# Altium project Rear_Power_Lower.PrjPcb
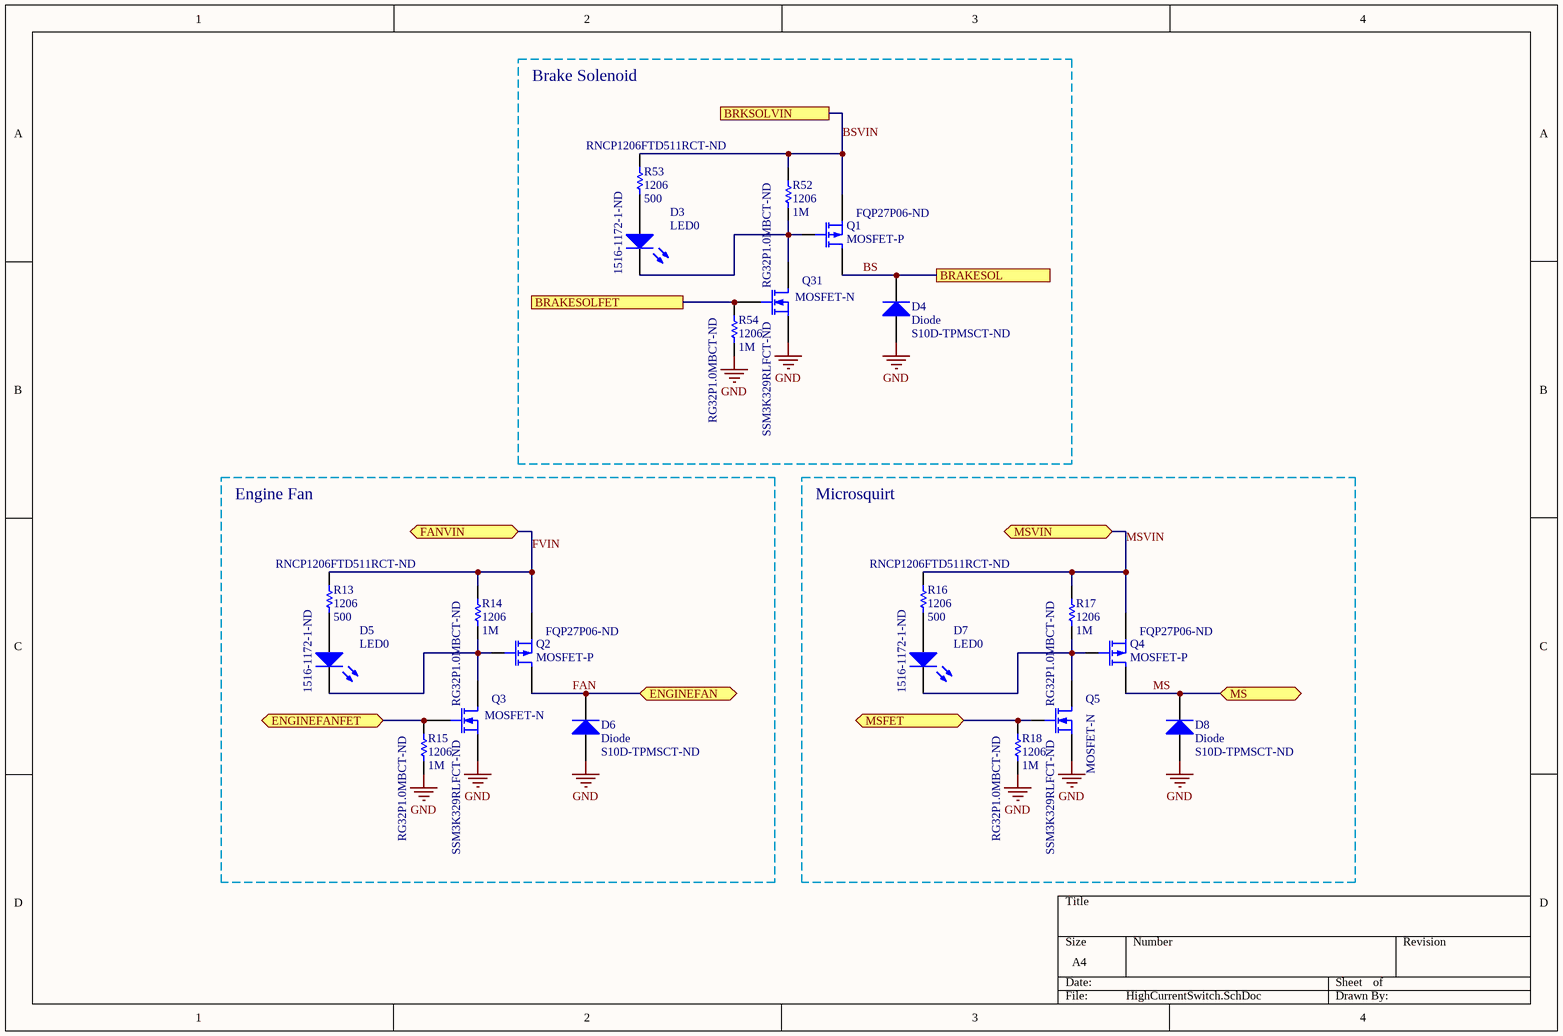
[diagram p0: HighCurrentSwitch.SchDoc]
5 sheets, 87 parts. Net scope: flat (ports and power ports of the same name join across sheets).
Board file: RPD_lower.PcbDoc
Sheets:
  HighCurrentSwitch.SchDoc
  RearPowerLower.SchDoc
  LowCurrentSwitch.SchDoc
  SpareSwitch.SchDoc
  Controller.SchDoc

## Sheet HighCurrentSwitch.SchDoc
size A4

### Parts
D3  LED0  Supplier Part Number 1: 1516-1172-1-ND  [C1206]
D4  Diode  Supplier Part Number 1: S10D-TPMSCT-ND  [S10D-TP]
D5  LED0  Supplier Part Number 1: 1516-1172-1-ND  [C1206]
D6  Diode  Supplier Part Number 1: S10D-TPMSCT-ND  [S10D-TP]
D7  LED0  Supplier Part Number 1: 1516-1172-1-ND  [C1206]
D8  Diode  Supplier Part Number 1: S10D-TPMSCT-ND  [S10D-TP]
Q1  MOSFET-P  Supplier Part Number 1: FQP27P06-ND  [TO-220]
Q2  MOSFET-P  Supplier Part Number 1: FQP27P06-ND  [TO-220]
Q3  MOSFET-N  Supplier Part Number 1: SSM3K329RLFCT-ND  [SOT23f]
Q4  MOSFET-P  Supplier Part Number 1: FQP27P06-ND  [TO-220]
Q5  MOSFET-N  Supplier Part Number 1: SSM3K329RLFCT-ND  [SOT23f]
Q31  MOSFET-N  Supplier Part Number 1: SSM3K329RLFCT-ND  [SOT23f]
R13  1206  value 500  Supplier Part Number 1: RNCP1206FTD511RCT-ND  [C1206]
R14  1206  value 1M  Supplier Part Number 1: RG32P1.0MBCT-ND  [1206 (High Density)]
R15  1206  value 1M  Supplier Part Number 1: RG32P1.0MBCT-ND  [1206 (High Density)]
R16  1206  value 500  Supplier Part Number 1: RNCP1206FTD511RCT-ND  [C1206]
R17  1206  value 1M  Supplier Part Number 1: RG32P1.0MBCT-ND  [1206 (High Density)]
R18  1206  value 1M  Supplier Part Number 1: RG32P1.0MBCT-ND  [1206 (High Density)]
R52  1206  value 1M  Supplier Part Number 1: RG32P1.0MBCT-ND  [1206 (High Density)]
R53  1206  value 500  Supplier Part Number 1: RNCP1206FTD511RCT-ND  [C1206]
R54  1206  value 1M  Supplier Part Number 1: RG32P1.0MBCT-ND  [1206 (High Density)]

### Blocks framed on the sheet
Brake Solenoid: D3 D4 Q1 Q31 R52-R54
Engine Fan: D5 D6 Q2 Q3 R13-R15
Microsquirt: D7 D8 Q4 Q5 R16-R18

### Ports
BRAKESOL, BRAKESOLFET, BRKSOLVIN, ENGINEFAN (bidir), ENGINEFANFET (bidir), FANVIN (bidir), MS (bidir), MSFET (bidir), MSVIN (bidir)

### Nets
GND: D4.1(A) D6.1(A) D8.1(A) Q3.3(S) Q5.3(S) Q31.3(S) R15.1 R18.1 R54.1
BS: D4.2(K) Q1.2(D) ; port BRAKESOL
BSVIN: Q1.3(S) R52.2 R53.1 ; port BRKSOLVIN
FAN: D6.2(K) Q2.2(D) ; port ENGINEFAN
FVIN: Q2.3(S) R13.1 R14.2 ; port FANVIN
MS: D8.2(K) Q4.2(D) ; port MS
MSVIN: Q4.3(S) R16.1 R17.2 ; port MSVIN
NetD3_1: D3.1(A) R53.2
NetD3_2: D3.2(K) Q1.1(G) Q31.1(D) R52.1
NetD5_1: D5.1(A) R13.2
NetD5_2: D5.2(K) Q2.1(G) Q3.1(D) R14.1
NetD7_1: D7.1(A) R16.2
NetD7_2: D7.2(K) Q4.1(G) Q5.1(D) R17.1
NetQ3_2: Q3.2(G) R15.2 ; port ENGINEFANFET
NetQ5_2: Q5.2(G) R18.2 ; port MSFET
NetQ31_2: Q31.2(G) R54.2 ; port BRAKESOLFET

### Library data of the parts
D3 D5 D7 = LED0: Typical INFRARED GaAs LED; Published: 8-Jun-2000; LatestRevisionDate: 08-Jul-2005; LatestRevisionNote: Mech Layer 1 removed.; PackageReference: LED-0; Publisher: Altium Limited; PackageDescription: LED; 2 Leads; Supplier 1: Digi-Key
D4 D6 D8 = Diode: Default Diode; Published: 8-Jun-2000; LatestRevisionDate: 17-Jul-2002; LatestRevisionNote: Re-released for DXP Platform.; PackageVersion: Sep-1996; PackageReference: SMC; Publisher: Altium Limited; PackageDescription: DO-214-AB/SMC; 2 C-Bend Leads; Body 7.9 x 5.9 mm, inc. leads (LxW); Code_JEDEC: DO-214-AB; Supplier 1: Digi-Key
Q1 Q2 Q4 = MOSFET-P: P-Channel MOSFET; Published: 8-Jun-2000; LatestRevisionDate: 17-Jul-2002; LatestRevisionNote: Re-released for DXP Platform.; PackageVersion: 1995/1996; PackageReference: E3; Publisher: Altium Limited; PackageDescription: TO, Flat Index; 3 In-Line, Axial Leads; Body Dia. 4.6mm; Lead Dia. 0.5 mm (max); Supplier 1: Digi-Key
Q3 Q5 Q31 = MOSFET-N: N-Channel MOSFET; Published: 8-Jun-2000; LatestRevisionDate: 17-Jul-2002; LatestRevisionNote: Re-released for DXP Platform.; PackageVersion: 1995/1996; PackageReference: E3; Publisher: Altium Limited; PackageDescription: TO, Flat Index; 3 In-Line, Axial Leads; Body Dia. 4.6mm; Lead Dia. 0.5 mm (max); Supplier 1: Digi-Key
R13-R18 R53 R54 = Res1: Resistor; Published: 8-Jun-2000; LatestRevisionDate: 17-Jul-2002; LatestRevisionNote: Re-released for DXP Platform.; PackageReference: AXIAL-0.3; Publisher: Altium Limited; PackageDescription: Axial Device, Thru-Hole; 2 Leads; 0.3 in Pin Spacing; Supplier 1: Digi-Key
R52 = Res1: 1M Resistor; Published: 8-Jun-2000; LatestRevisionDate: 17-Jul-2002; LatestRevisionNote: Re-released for DXP Platform.; PackageReference: AXIAL-0.3; Publisher: Altium Limited; PackageDescription: Axial Device, Thru-Hole; 2 Leads; 0.3 in Pin Spacing; Supplier 1: Digi-Key

## Sheet RearPowerLower.SchDoc
size A4
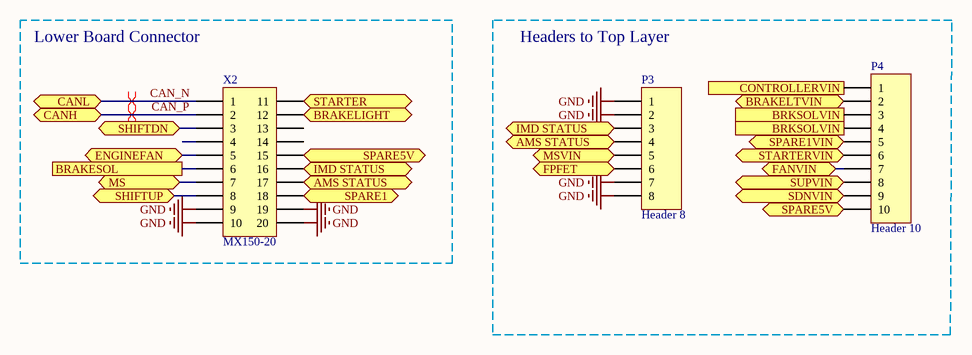
[diagram p1: RearPowerLower.SchDoc]

### Parts
P3  Header 8  [HDR1X8]
P4  Header 10  [HDR1X10]
X2  MX150-20  [20 Pin MX150]

### Blocks framed on the sheet
Lower Board Connector: X2
Headers to Top Layer: P3 P4

### Ports
AMS STATUS (bidir), BRAKELIGHT (bidir), BRAKELTVIN (bidir), BRAKESOL, BRKSOLVIN, CANH (bidir), CANL (bidir), CONTROLLERVIN, ENGINEFAN (bidir), FANVIN (bidir), FPFET (bidir), IMD STATUS (bidir), MS (bidir), MSVIN (bidir), SDNVIN (bidir), SHIFTDN (bidir), SHIFTUP (bidir), SPARE1 (bidir), SPARE1VIN (bidir), SPARE5V (bidir), STARTER (bidir), STARTERVIN (bidir), SUPVIN (bidir)

### Nets
GND: P3.1 P3.2 P3.7 P3.8 X2.9 X2.10 X2.19 X2.20
BS: X2.6 ; port BRAKESOL
BSVIN: P4.3 P4.4 ; port BRKSOLVIN
CAN_N: X2.1 ; port CANL
CAN_P: X2.2 ; port CANH
FAN: X2.5 ; port ENGINEFAN
FVIN: P4.7 ; port FANVIN
MS: X2.7 ; port MS
MSVIN: P3.5 ; port MSVIN
VIN: P4.1 ; port CONTROLLERVIN
NetD10_2: X2.3 ; port SHIFTDN
NetD13_2: X2.8 ; port SHIFTUP
NetD15_2: X2.11 ; port STARTER
NetD16_2: X2.12 ; port BRAKELIGHT
NetD20_2: X2.18 ; port SPARE1
NetP3_3: P3.3 X2.16 ; port IMD STATUS
NetP3_4: P3.4 X2.17 ; port AMS STATUS
NetP3_6: P3.6 ; port FPFET
NetP4_2: P4.2 ; port BRAKELTVIN
NetP4_5: P4.5 ; port SPARE1VIN
NetP4_6: P4.6 ; port STARTERVIN
NetP4_8: P4.8 ; port SUPVIN
NetP4_9: P4.9 ; port SDNVIN
NetP4_10: P4.10 X2.15 ; port SPARE5V

Not connected (* = marked no-connect by the designer): X2 4 13 14

### Layout directives
differential pair: CAN_N, CAN_P

### Library data of the parts
P3 = Header 8: Header, 8-Pin; LatestRevisionDate: 17-Jul-2002; LatestRevisionNote: Re-released for DXP Platform.; Publisher: Altium Limited; Supplier 1: Digi-key; Supplier Part Number 1: S7006-ND; Supplier Part Number 2: *
P4 = Header 10: Header, 10-Pin; LatestRevisionDate: 17-Jul-2002; LatestRevisionNote: Re-released for DXP Platform.; Publisher: Altium Limited; Supplier 1: Digi-Key; Supplier Part Number 1: S7008-ND; Supplier Part Number 2: *
X2 = Header 10X2A: Header, 10-Pin, Dual row; LatestRevisionDate: 17-Jul-2002; LatestRevisionNote: Re-released for DXP Platform.; Publisher: Altium Limited

## Sheet LowCurrentSwitch.SchDoc
size A4
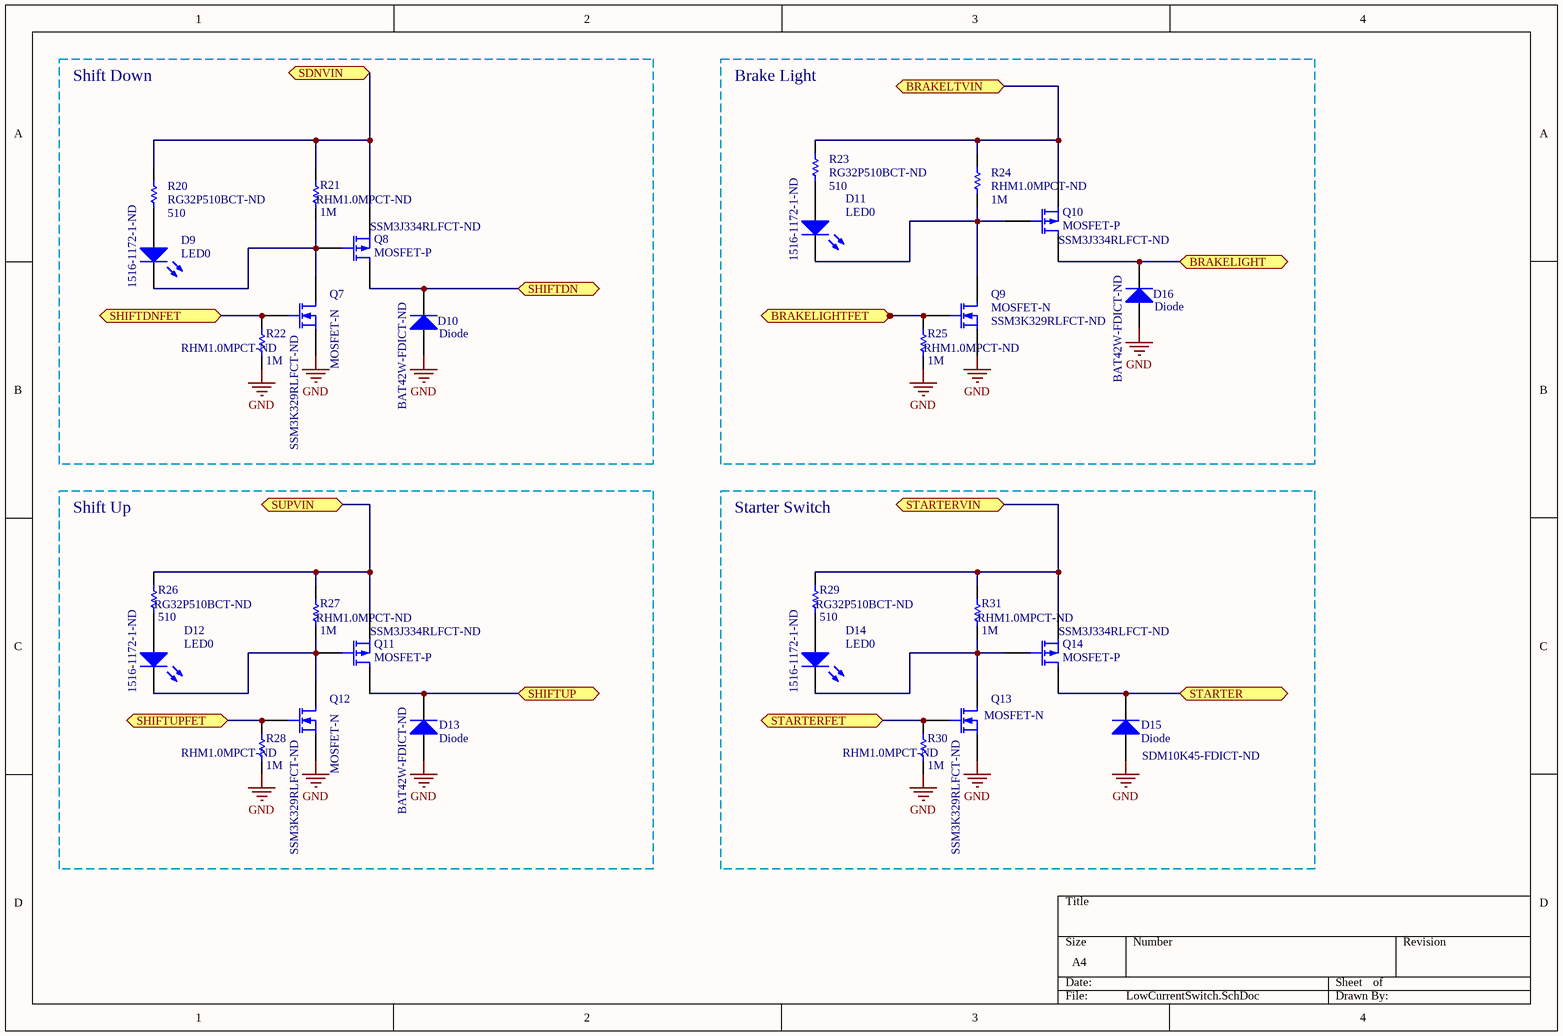
[diagram p2: LowCurrentSwitch.SchDoc]

### Parts
D9  LED0  Supplier Part Number 1: 1516-1172-1-ND  [C1206]
D10  Diode  Supplier Part Number 1: BAT42W-FDICT-ND  [sod-123]
D11  LED0  Supplier Part Number 1: 1516-1172-1-ND  [C1206]
D12  LED0  Supplier Part Number 1: 1516-1172-1-ND  [C1206]
D13  Diode  Supplier Part Number 1: BAT42W-FDICT-ND  [sod-123]
D14  LED0  Supplier Part Number 1: 1516-1172-1-ND  [C1206]
D15  Diode  Supplier Part Number 1: SDM10K45-FDICT-ND  [SOD-323]
D16  Diode  Supplier Part Number 1: BAT42W-FDICT-ND  [sod-123]
Q7  MOSFET-N  Supplier Part Number 1: SSM3K329RLFCT-ND  [SOT23f]
Q8  MOSFET-P  Supplier Part Number 1: SSM3J334RLFCT-ND  [SOT23f]
Q9  MOSFET-N  Supplier Part Number 1: SSM3K329RLFCT-ND  [SOT23f]
Q10  MOSFET-P  Supplier Part Number 1: SSM3J334RLFCT-ND  [SOT23f]
Q11  MOSFET-P  Supplier Part Number 1: SSM3J334RLFCT-ND  [SOT23f]
Q12  MOSFET-N  Supplier Part Number 1: SSM3K329RLFCT-ND  [SOT23f]
Q13  MOSFET-N  Supplier Part Number 1: SSM3K329RLFCT-ND  [SOT23f]
Q14  MOSFET-P  Supplier Part Number 1: SSM3J334RLFCT-ND  [SOT23f]
R20  value 510  Supplier Part Number 1: RG32P510BCT-ND  [C1206]  (hidden comment: 1206)
R21  value 1M  Supplier Part Number 1: RHM1.0MPCT-ND  [C1206]  (hidden comment: 1206)
R22  value 1M  Supplier Part Number 1: RHM1.0MPCT-ND  [C1206]  (hidden comment: 1206)
R23  value 510  Supplier Part Number 1: RG32P510BCT-ND  [C1206]  (hidden comment: 1206)
R24  value 1M  Supplier Part Number 1: RHM1.0MPCT-ND  [C1206]  (hidden comment: Res1)
R25  value 1M  Supplier Part Number 1: RHM1.0MPCT-ND  [C1206]  (hidden comment: Res1)
R26  value 510  Supplier Part Number 1: RG32P510BCT-ND  [C1206]  (hidden comment: 1206)
R27  value 1M  Supplier Part Number 1: RHM1.0MPCT-ND  [C1206]  (hidden comment: 1206)
R28  value 1M  Supplier Part Number 1: RHM1.0MPCT-ND  [C1206]  (hidden comment: 1206)
R29  value 510  Supplier Part Number 1: RG32P510BCT-ND  [C1206]  (hidden comment: 1206)
R30  value 1M  Supplier Part Number 1: RHM1.0MPCT-ND  [C1206]  (hidden comment: 1206)
R31  value 1M  Supplier Part Number 1: RHM1.0MPCT-ND  [C1206]  (hidden comment: 1206)

### Blocks framed on the sheet
Shift Down: D9 D10 Q7 Q8 R20-R22
Brake Light: D11 D16 Q9 Q10 R23-R25
Shift Up: D12 D13 Q11 Q12 R26-R28
Starter Switch: D14 D15 Q13 Q14 R29-R31

### Ports
BRAKELIGHT (bidir), BRAKELIGHTFET (bidir), BRAKELTVIN (bidir), SDNVIN (bidir), SHIFTDN (bidir), SHIFTDNFET (bidir), SHIFTUP (bidir), SHIFTUPFET (bidir), STARTER (bidir), STARTERFET (bidir), STARTERVIN (bidir), SUPVIN (bidir)

### Nets
GND: D10.1(A) D13.1(A) D15.1(A) D16.1(A) Q7.3(S) Q9.3(S) Q12.3(S) Q13.3(S) R22.1 R25.1 R28.1 R30.1
NetD9_1: D9.1(A) R20.2
NetD9_2: D9.2(K) Q7.1(D) Q8.2(G) R21.1
NetD10_2: D10.2(K) Q8.1(D) ; port SHIFTDN
NetD11_1: D11.1(A) R23.2
NetD11_2: D11.2(K) Q9.1(D) Q10.2(G) R24.1
NetD12_1: D12.1(A) R26.2
NetD12_2: D12.2(K) Q11.2(G) Q12.1(D) R27.1
NetD13_2: D13.2(K) Q11.1(D) ; port SHIFTUP
NetD14_1: D14.1(A) R29.2
NetD14_2: D14.2(K) Q13.1(D) Q14.2(G) R31.1
NetD15_2: D15.2(K) Q14.1(D) ; port STARTER
NetD16_2: D16.2(K) Q10.1(D) ; port BRAKELIGHT
NetP4_2: Q10.3(S) R23.1 R24.2 ; port BRAKELTVIN
NetP4_6: Q14.3(S) R29.1 R31.2 ; port STARTERVIN
NetP4_8: Q11.3(S) R26.1 R27.2 ; port SUPVIN
NetP4_9: Q8.3(S) R20.1 R21.2 ; port SDNVIN
NetQ7_2: Q7.2(G) R22.2 ; port SHIFTDNFET
NetQ9_2: Q9.2(G) R25.2 ; port BRAKELIGHTFET
NetQ12_2: Q12.2(G) R28.2 ; port SHIFTUPFET
NetQ13_2: Q13.2(G) R30.2 ; port STARTERFET

### Library data of the parts
D9 D11 D12 D14 = LED0: Typical INFRARED GaAs LED; Published: 8-Jun-2000; LatestRevisionDate: 08-Jul-2005; LatestRevisionNote: Mech Layer 1 removed.; PackageReference: LED-0; Publisher: Altium Limited; PackageDescription: LED; 2 Leads; Supplier 1: Digi-Key
D10 D13 D15 D16 = Diode: Default Diode; Published: 8-Jun-2000; LatestRevisionDate: 17-Jul-2002; LatestRevisionNote: Re-released for DXP Platform.; PackageVersion: Sep-1996; PackageReference: SMC; Publisher: Altium Limited; PackageDescription: DO-214-AB/SMC; 2 C-Bend Leads; Body 7.9 x 5.9 mm, inc. leads (LxW); Code_JEDEC: DO-214-AB; Supplier 1: Digi-Key
Q7 Q9 Q12 Q13 = MOSFET-N: N-Channel MOSFET; Published: 8-Jun-2000; LatestRevisionDate: 17-Jul-2002; LatestRevisionNote: Re-released for DXP Platform.; PackageVersion: 1995/1996; PackageReference: E3; Publisher: Altium Limited; PackageDescription: TO, Flat Index; 3 In-Line, Axial Leads; Body Dia. 4.6mm; Lead Dia. 0.5 mm (max); Supplier 1: Digi-Key
Q8 Q10 Q11 Q14 = MOSFET-P: P-Channel MOSFET; Published: 8-Jun-2000; LatestRevisionDate: 17-Jul-2002; LatestRevisionNote: Re-released for DXP Platform.; PackageVersion: 1995/1996; PackageReference: E3; Publisher: Altium Limited; PackageDescription: TO, Flat Index; 3 In-Line, Axial Leads; Body Dia. 4.6mm; Lead Dia. 0.5 mm (max); Supplier 1: Digi-Key
R20-R31 = Res1: Resistor; Published: 8-Jun-2000; LatestRevisionDate: 17-Jul-2002; LatestRevisionNote: Re-released for DXP Platform.; PackageReference: AXIAL-0.3; Publisher: Altium Limited; PackageDescription: Axial Device, Thru-Hole; 2 Leads; 0.3 in Pin Spacing; Supplier 1: Digi-Key

## Sheet SpareSwitch.SchDoc
size A4
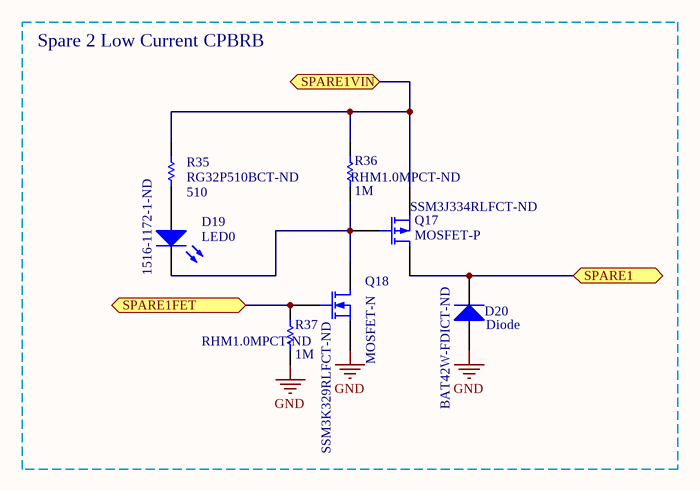
[diagram p3: SpareSwitch.SchDoc]

### Parts
D19  LED0  Supplier Part Number 1: 1516-1172-1-ND  [C1206]
D20  Diode  Supplier Part Number 1: BAT42W-FDICT-ND  [sod-123]
Q17  MOSFET-P  Supplier Part Number 1: SSM3J334RLFCT-ND  [SOT23f]
Q18  MOSFET-N  Supplier Part Number 1: SSM3K329RLFCT-ND  [SOT23f]
R35  value 510  Supplier Part Number 1: RG32P510BCT-ND  [C1206]  (hidden comment: 1206)
R36  value 1M  Supplier Part Number 1: RHM1.0MPCT-ND  [C1206]  (hidden comment: 1206)
R37  value 1M  Supplier Part Number 1: RHM1.0MPCT-ND  [C1206]  (hidden comment: 1206)

### Blocks framed on the sheet
Spare 2 Low Current CPBRB: D19 D20 Q17 Q18 R35-R37

### Ports
SPARE1 (bidir), SPARE1FET (bidir), SPARE1VIN (bidir)

### Nets
GND: D20.1(A) Q18.3(S) R37.1
NetD19_1: D19.1(A) R35.2
NetD19_2: D19.2(K) Q17.2(G) Q18.1(D) R36.1
NetD20_2: D20.2(K) Q17.1(D) ; port SPARE1
NetP4_5: Q17.3(S) R35.1 R36.2 ; port SPARE1VIN
NetQ18_2: Q18.2(G) R37.2 ; port SPARE1FET

### Library data of the parts
D19 = LED0: Typical INFRARED GaAs LED; Published: 8-Jun-2000; LatestRevisionDate: 08-Jul-2005; LatestRevisionNote: Mech Layer 1 removed.; PackageReference: LED-0; Publisher: Altium Limited; PackageDescription: LED; 2 Leads; Supplier 1: Digi-Key
D20 = Diode: Default Diode; Published: 8-Jun-2000; LatestRevisionDate: 17-Jul-2002; LatestRevisionNote: Re-released for DXP Platform.; PackageVersion: Sep-1996; PackageReference: SMC; Publisher: Altium Limited; PackageDescription: DO-214-AB/SMC; 2 C-Bend Leads; Body 7.9 x 5.9 mm, inc. leads (LxW); Code_JEDEC: DO-214-AB; Supplier 1: Digi-Key
Q17 = MOSFET-P: P-Channel MOSFET; Published: 8-Jun-2000; LatestRevisionDate: 17-Jul-2002; LatestRevisionNote: Re-released for DXP Platform.; PackageVersion: 1995/1996; PackageReference: E3; Publisher: Altium Limited; PackageDescription: TO, Flat Index; 3 In-Line, Axial Leads; Body Dia. 4.6mm; Lead Dia. 0.5 mm (max); Supplier 1: Digi-Key
Q18 = MOSFET-N: N-Channel MOSFET; Published: 8-Jun-2000; LatestRevisionDate: 17-Jul-2002; LatestRevisionNote: Re-released for DXP Platform.; PackageVersion: 1995/1996; PackageReference: E3; Publisher: Altium Limited; PackageDescription: TO, Flat Index; 3 In-Line, Axial Leads; Body Dia. 4.6mm; Lead Dia. 0.5 mm (max); Supplier 1: Digi-Key
R35-R37 = Res1: Resistor; Published: 8-Jun-2000; LatestRevisionDate: 17-Jul-2002; LatestRevisionNote: Re-released for DXP Platform.; PackageReference: AXIAL-0.3; Publisher: Altium Limited; PackageDescription: Axial Device, Thru-Hole; 2 Leads; 0.3 in Pin Spacing; Supplier 1: Digi-Key

## Sheet Controller.SchDoc
size A4
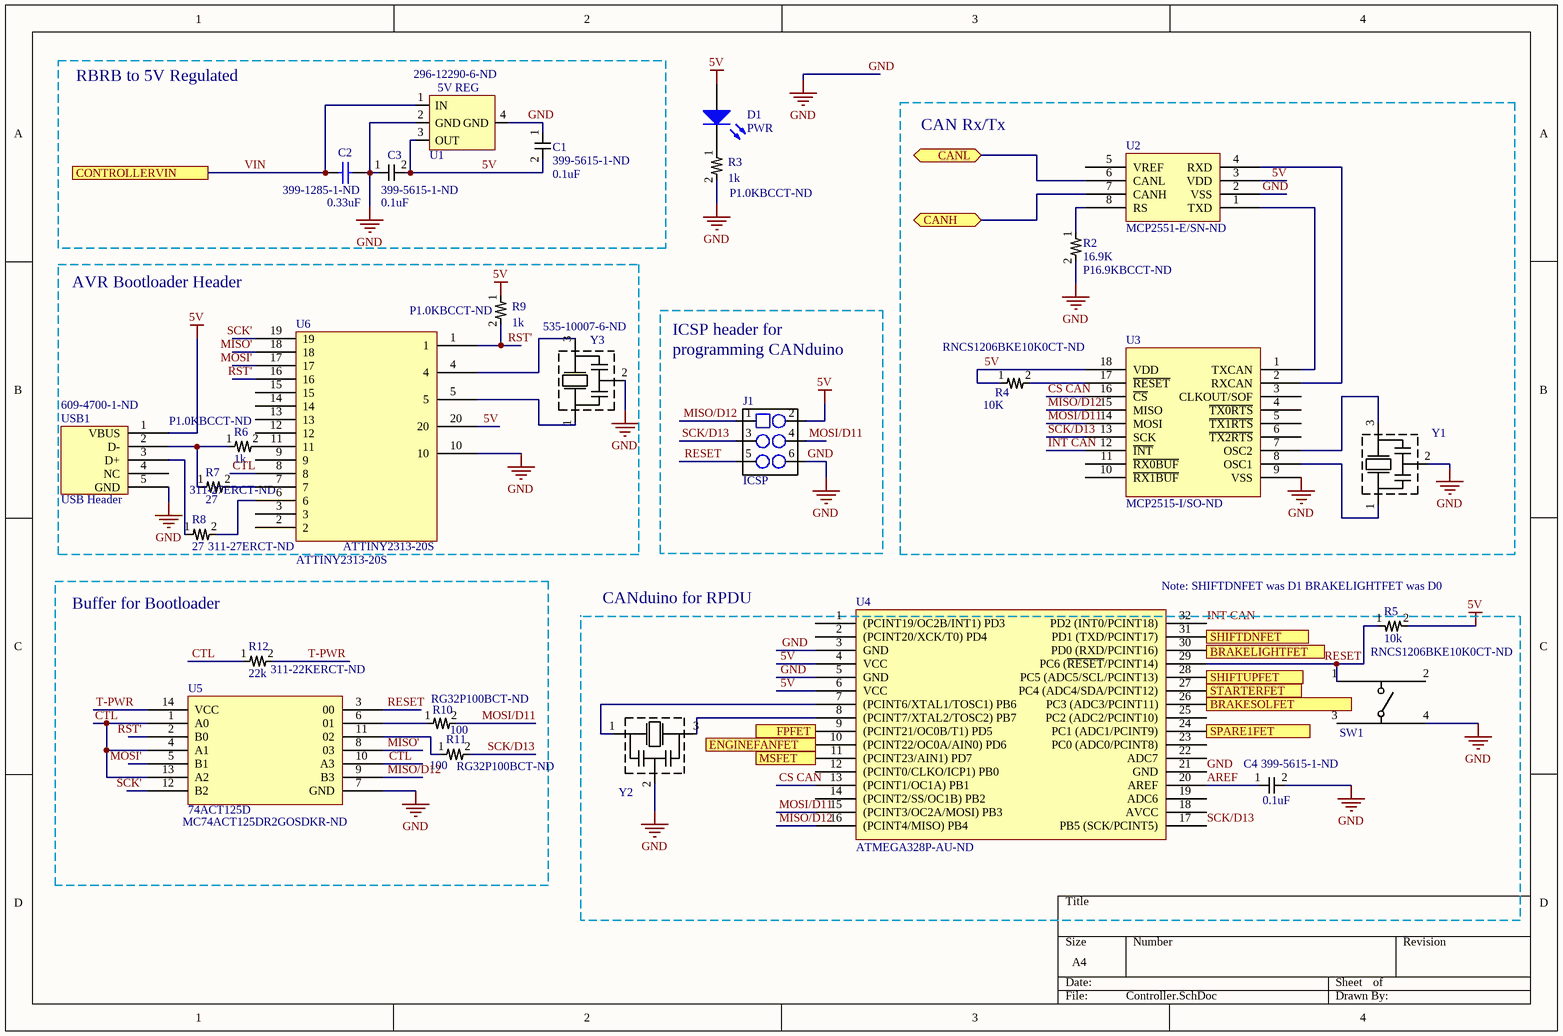
[diagram p4: Controller.SchDoc]

### Parts
C1  0.1uF  Supplier Part Number 1: 399-5615-1-ND  [C1206]
C2  value 0.33uF  Supplier Part Number 1: 399-1285-1-ND  [C1206]
C3  0.1uF  Supplier Part Number 1: 399-5615-1-ND  [C1206]
C4  0.1uF  Supplier Part Number 1: 399-5615-1-ND  [C1206]
D1  PWR  [3.2X1.6X1.1]
J1  ICSP  [ICSP Connector]
R2  16.9K  Supplier Part Number 1: P16.9KBCCT-ND  [C1206]
R3  1k  Supplier Part Number 1: P1.0KBCCT-ND  [C1206]
R4  10K  Supplier Part Number 1: RNCS1206BKE10K0CT-ND  [C1206]
R5  10k  Supplier Part Number 2: RNCS1206BKE10K0CT-ND  [C1206]
R6  1k  Supplier Part Number 1: P1.0KBCCT-ND  [C1206]
R7  27  Supplier Part Number 1: 311-27ERCT-ND  [C1206]
R8  27  Supplier Part Number 1: 311-27ERCT-ND  [C1206]
R9  1k  Supplier Part Number 1: P1.0KBCCT-ND  [C1206]
R10  100  Supplier Part Number 1: RG32P100BCT-ND  [C1206]
R11  100  Supplier Part Number 1: RG32P100BCT-ND  [C1206]
R12  22k  Supplier Part Number 1: 311-22KERCT-ND  [C1206]
SW1  PTS525SM15SMTR2  [PTS525SM15SMTR2]  (value not drawn)
U1  Supplier Part Number 1: 296-12290-6-ND  [SOT223]  (hidden comment: UA7805CKTTR)
U2  Supplier Part Number 1: MCP2551-E/SN-ND  [SOIC127P600X175-8M]  (hidden comment: MCP2551-E/SN)
U3  Supplier Part Number 1: MCP2515-I/SO-ND  [SOIC127P1030X265-18M]  (hidden comment: MCP2515-E/ST)
U4  Supplier Part Number 1: ATMEGA328P-AU-ND  [ATMEGA328P-15AZ - 2]  (hidden comment: ATMEGA328P)
U5  74ACT125D  Supplier Part Number 1: MC74ACT125DR2GOSDKR-ND  [14 pin buffer]
U6  ATTINY2313-20S  [ATTINY]
USB1  USB Header  Supplier Part Number 1: 609-4700-1-ND  [USBminiB]
Y1  CSTCE16M0V53-R0  [CSTCE16M0V53-R0]  (value not drawn)
Y2  CSTCE16M0V53-R0  [CSTCE16M0V53-R0]  (value not drawn)
Y3  Supplier Part Number 1: 535-10007-6-ND  [12MHzCRES]  (hidden comment: CSTCE16M0V53-R0)

### Blocks framed on the sheet
RBRB to 5V Regulated: C1-C3 U1
CAN Rx/Tx: R2 R4 U2 U3 Y1
AVR Bootloader Header: R6-R9 U6 USB1 Y3
Buffer for Bootloader: R10-R12 U5

### Ports
BRAKELIGHTFET, BRAKESOLFET, CANH (bidir), CANL (bidir), CONTROLLERVIN, ENGINEFANFET, FPFET, MSFET, SHIFTDNFET, SHIFTUPFET, SPARE1FET, STARTERFET

### Nets
5V: C1.2 C3.2 D1.1(A) J1.2 R4.1 R5.2 R9.1 U1.3(OUT) U2.3(VDD) U3.18(VDD) U4.4(VCC) U4.6(VCC) U6.20 USB1.1(VBUS)
GND: C1.1 C2.2 C3.1 C4.2 J1.6 R2.2 R3.2 SW1.4 U1.2(GND) U1.4(GND) U2.2(VSS) U3.9(VSS) U4.3(GND) U4.5(GND) U4.21(GND) U5.7(GND) U6.10 USB1.5(GND) Y1.2 Y2.2 Y3.2
AREF: C4.1 U4.20(AREF)
CAN_N: U2.6(CANL) ; port CANL
CAN_P: U2.7(CANH) ; port CANH
CS CAN: U3.16(~{CS}) U4.13((PCINT1/OC1A)_PB1)
CTL: R12.1 U5.1(A0) U5.4(A1) U5.10(A3) U5.13(A2) U6.8
INT CAN: U3.12(~{INT}) U4.32(PD2_(INT0/PCINT18))
MISO': U5.8(03) U6.18
MISO/D12: J1.1 U3.15(MISO) U4.16((PCINT4/MISO)_PB4) U5.9(B3)
MOSI': U5.5(B1) U6.17
MOSI/D11: J1.4 R10.2 U3.14(MOSI) U4.15((PCINT3/OC2A/MOSI)_PB3)
RESET: J1.5 R5.1 SW1.1 U4.29(PC6_(~{RESET}/PCINT14)) U5.3(00)
RST': R9.2 U5.2(B0) U6.1 U6.16
SCK': U5.12(B2) U6.19
SCK/D13: J1.3 R11.2 U3.13(SCK) U4.17(PB5_(SCK/PCINT5))
T-PWR: R12.2 U5.14(VCC)
VIN: C2.1 U1.1(IN) ; port CONTROLLERVIN
NetD1_2: D1.2(K) R3.1
NetP3_6: U4.9((PCINT21/OC0B/T1)_PD5) ; port FPFET
NetQ3_2: U4.10((PCINT22/OC0A/AIN0)_PD6) ; port ENGINEFANFET
NetQ5_2: U4.11((PCINT23/AIN1)_PD7) ; port MSFET
NetQ7_2: U4.31(PD1_(TXD/PCINT17)) ; port SHIFTDNFET
NetQ12_2: U4.28(PC5_(ADC5/SCL/PCINT13)) ; port SHIFTUPFET
NetQ13_2: U4.27(PC4_(ADC4/SDA/PCINT12)) ; port STARTERFET
NetQ18_2: U4.24(PC1_(ADC1/PCINT9)) ; port SPARE1FET
NetQ31_2: U4.26(PC3_(ADC3/PCINT11)) ; port BRAKESOLFET
NetR2_1: R2.1 U2.8(RS)
NetR4_2: R4.2 U3.17(~{RESET})
NetR6_1: R6.1 R7.1 USB1.2(D-)
NetR7_2: R7.2 U6.7
NetR8_1: R8.1 USB1.3(D+)
NetR8_2: R8.2 U6.6
NetR10_1: R10.1 U5.6(01)
NetR11_1: R11.1 U5.11(02)
NetU2_1: U2.1(TXD) U3.1(TXCAN)
NetU2_4: U2.4(RXD) U3.2(RXCAN)
NetU3_7: U3.7(OSC2) Y1.3
NetU3_8: U3.8(OSC1) Y1.1
NetU4_7: U4.7((PCINT6/XTAL1/TOSC1)_PB6) Y2.1
NetU4_8: U4.8((PCINT7/XTAL2/TOSC2)_PB7) Y2.3
NetU6_4: U6.4 Y3.3
NetU6_5: U6.5 Y3.1

Not connected (* = marked no-connect by the designer): R6 2; SW1 2 3; U2 5(VREF); U3 3(CLKOUT/SOF) 4(~{TX0RTS}) 5(~{TX1RTS}) 6(~{TX2RTS}) 10(~{RX1BUF}) 11(~{RX0BUF}); U4 1((PCINT19/OC2B/INT1)_PD3) 2((PCINT20/XCK/T0)_PD4) 12((PCINT0/CLKO/ICP1)_PB0) 14((PCINT2/SS/OC1B)_PB2) 18(AVCC) 19(ADC6) 22(ADC7) 23(PC0_(ADC0/PCINT8)) 25(PC2_(ADC2/PCINT10)) 30(PD0_(RXD/PCINT16)); U6 2 3 9 11 12 13 14 15; USB1 4(NC)

### Notes on the sheet
- ICSP header for
- programming CANduino
- CANduino for RPDU
- Note: SHIFTDNFET was D1 BRAKELIGHTFET was D0
- (in symbol UA7805CKTTR) 5V REG

### Library data of the parts
C1 C4 = Capacitor: 0603; Supplier 1: Digi-Key
C2 = Cap Semi: Capacitor (Semiconductor SIM Model); Published: 8-Jun-2000; LatestRevisionDate: 29-May-2009; LatestRevisionNote: IPC-7351 Footprint Added.; PackageReference: C1206; Publisher: Altium Limited; PackageDescription: Chip Capacitor; Supplier 1: Digi-Key
C3 = Capacitor: Supplier 1: Digi-Key
D1 = LED2: Typical RED, GREEN, YELLOW, AMBER GaAs LED; Published: 8-Jun-2000; LatestRevisionDate: 17-Jul-2002; LatestRevisionNote: Re-released for DXP Platform.; PackageVersion: Feb-2002; PackageReference: 3.2X1.6X1.1; Publisher: Altium Limited; PackageDescription: SM LED; 2 Flat Leads; Supplier 1: Digi-Key; Supplier Part Number 1: 160-1456-1-ND
J1 = ICSP Connector: Supplier 1: Digi-Key; Supplier Part Number 1: 952-2121-ND
R2 R4 R9 = Resistor: 0603; Supplier 1: Digi-Key
R3 R5-R8 R10-R12 = Resistor: 1206; Supplier 1: Digi-Key
  R5: Supplier 2: Digi-Key
U1 = UA7805CKTTR: 12V to 5V LDO 296-12290-1-ND; Supplier 1: Digi-Key
U2 = MCP2551-E/SN: SOIC; Supplier 1: Digi-Key
U3 = MCP2515-E/ST: SOIC; Supplier 1: Digi-Key
U4 = ATMEGA328P: TQFN; Supplier 1: Digi-Key
U5 = 74ACT125D: Buffer MC74ACT125DR2GOSCT-ND; Supplier 1: Digi-Key
U6 = ATTINY2313-20S: ATTINY; Supplier 1: Digi-Key; Supplier Part Number 1: ATTINY2313-20SURCT-ND
USB1 = USB Header: USB mini B 609-4700-1-ND; Supplier 1: Digi-Key
Y1 Y3 = CSTCE16M0V53-R0: 16MHz 15pf resonator 490-1198-1-ND; Supplier 1: Digi-Key
  Y1: Supplier Part Number 1: 490-1198-1-ND
SW1 = PTS525SM15SMTR2: Supplier 1: Digi-Key; Supplier Part Number 1: CKN9104CT-ND
Y2 = CSTCE16M0V53-R0: Supplier 1: Digi-Key; Supplier Part Number 1: 490-1198-1-ND

## Nets that join several sheets
GND: HighCurrentSwitch (9 pins), RearPowerLower (8 pins), LowCurrentSwitch (12 pins), SpareSwitch (D20.1 Q18.3 R37.1), Controller (21 pins)
BS: HighCurrentSwitch (D4.2 Q1.2), RearPowerLower (X2.6)
BSVIN: HighCurrentSwitch (Q1.3 R52.2 R53.1), RearPowerLower (P4.3 P4.4)
CAN_N: RearPowerLower (X2.1), Controller (U2.6)
CAN_P: RearPowerLower (X2.2), Controller (U2.7)
FAN: HighCurrentSwitch (D6.2 Q2.2), RearPowerLower (X2.5)
FVIN: HighCurrentSwitch (Q2.3 R13.1 R14.2), RearPowerLower (P4.7)
MS: HighCurrentSwitch (D8.2 Q4.2), RearPowerLower (X2.7)
MSVIN: HighCurrentSwitch (Q4.3 R16.1 R17.2), RearPowerLower (P3.5)
NetD10_2: RearPowerLower (X2.3), LowCurrentSwitch (D10.2 Q8.1)
NetD13_2: RearPowerLower (X2.8), LowCurrentSwitch (D13.2 Q11.1)
NetD15_2: RearPowerLower (X2.11), LowCurrentSwitch (D15.2 Q14.1)
NetD16_2: RearPowerLower (X2.12), LowCurrentSwitch (D16.2 Q10.1)
NetD20_2: RearPowerLower (X2.18), SpareSwitch (D20.2 Q17.1)
NetP3_6: RearPowerLower (P3.6), Controller (U4.9)
NetP4_2: RearPowerLower (P4.2), LowCurrentSwitch (Q10.3 R23.1 R24.2)
NetP4_5: RearPowerLower (P4.5), SpareSwitch (Q17.3 R35.1 R36.2)
NetP4_6: RearPowerLower (P4.6), LowCurrentSwitch (Q14.3 R29.1 R31.2)
NetP4_8: RearPowerLower (P4.8), LowCurrentSwitch (Q11.3 R26.1 R27.2)
NetP4_9: RearPowerLower (P4.9), LowCurrentSwitch (Q8.3 R20.1 R21.2)
NetQ3_2: HighCurrentSwitch (Q3.2 R15.2), Controller (U4.10)
NetQ5_2: HighCurrentSwitch (Q5.2 R18.2), Controller (U4.11)
NetQ7_2: LowCurrentSwitch (Q7.2 R22.2), Controller (U4.31)
NetQ12_2: LowCurrentSwitch (Q12.2 R28.2), Controller (U4.28)
NetQ13_2: LowCurrentSwitch (Q13.2 R30.2), Controller (U4.27)
NetQ18_2: SpareSwitch (Q18.2 R37.2), Controller (U4.24)
NetQ31_2: HighCurrentSwitch (Q31.2 R54.2), Controller (U4.26)
VIN: RearPowerLower (P4.1), Controller (C2.1 U1.1)